# EAGLE design Martin-V-USB_Mame_Panel_Atmega8ISP-V18 (EAGLE 6.3)
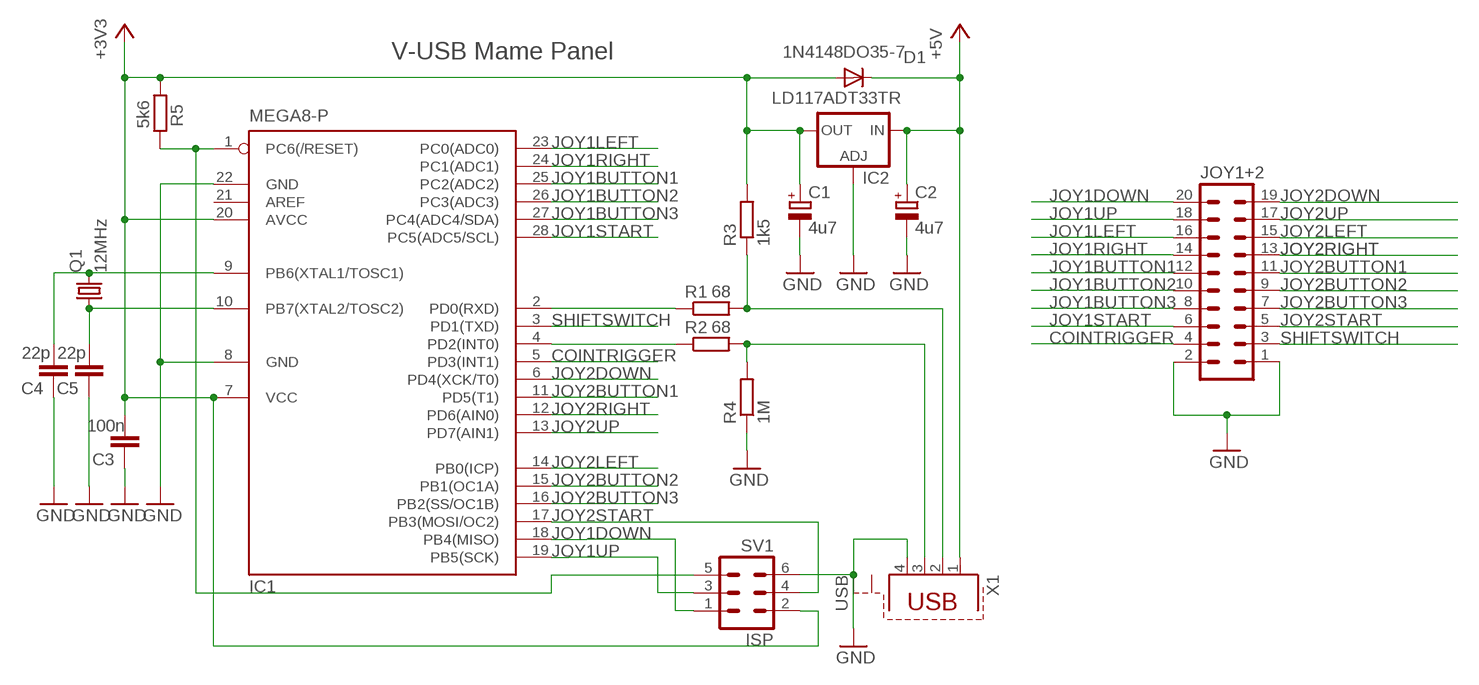
[diagram p0: schematic, sheet 1]

## Parts
C1  4u7  CPOL-EUE2.5-5  [E2,5-5]
C2  4u7  CPOL-EUE2.5-5  [E2,5-5]
C3  100n  C-EU050-030X075  [C050-030X075]
C4  22p  C-EU025-025X050  [C025-025X050]
C5  22p  C-EU025-025X050  [C025-025X050]
D1  1N4148DO35-7  [DO35-7]
IC1  MEGA8-P  [DIL28-3]
IC2  LD117ADT33TR  [DPACK]
JOY1+2  MA10-2W  [MA10-2W]
Q1  12MHz  CRYSTALHC18U-V  [HC18U-V]
R1  68  R-EU_0207/10  [0207/10]
R2  68  R-EU_0207/10  [0207/10]
R3  1k5  R-EU_0207/10  [0207/10]
R4  1M  R-EU_0207/10  [0207/10]
R5  5k6  R-EU_0207/10  [0207/10]
SV1  ISP  ML6  [ML6]
X1  USB  PN61729-S  [PN61729-S]

## Nets
+3V3: C1.+ C3.2 D1.A IC1.7(VCC) IC1.20(AVCC) IC2.4(OUT) R3.2 R5.1 SV1.2
+5V: C2.+ D1.C IC2.3(IN) X1.1
COINTRIGGER: IC1.5(PD3(INT1)) JOY1+2.4
GND: C1.- C2.- C3.1 C4.1 C5.1 IC1.8(GND) IC1.22(GND) IC2.1(ADJ) JOY1+2.1 JOY1+2.2 R4.1 SV1.6 X1.4
JOY1BUTTON1: IC1.25(PC2(ADC2)) JOY1+2.12
JOY1BUTTON2: IC1.26(PC3(ADC3)) JOY1+2.10
JOY1BUTTON3: IC1.27(PC4(ADC4/SDA)) JOY1+2.8
JOY1DOWN: IC1.18(PB4(MISO)) JOY1+2.20 SV1.1
JOY1LEFT: IC1.23(PC0(ADC0)) JOY1+2.16
JOY1RIGHT: IC1.24(PC1(ADC1)) JOY1+2.14
JOY1START: IC1.28(PC5(ADC5/SCL)) JOY1+2.6
JOY1UP: IC1.19(PB5(SCK)) JOY1+2.18 SV1.3
JOY2BUTTON1: IC1.11(PD5(T1)) JOY1+2.11
JOY2BUTTON2: IC1.15(PB1(OC1A)) JOY1+2.9
JOY2BUTTON3: IC1.16(PB2(SS/OC1B)) JOY1+2.7
JOY2DOWN: IC1.6(PD4(XCK/T0)) JOY1+2.19
JOY2LEFT: IC1.14(PB0(ICP)) JOY1+2.15
JOY2RIGHT: IC1.12(PD6(AIN0)) JOY1+2.13
JOY2START: IC1.17(PB3(MOSI/OC2)) JOY1+2.5 SV1.4
JOY2UP: IC1.13(PD7(AIN1)) JOY1+2.17
N$1: IC1.2(PD0(RXD)) R1.1
N$2: IC1.4(PD2(INT0)) R2.1
N$3: IC1.1(PC6(/RESET)) R5.2 SV1.5
N$4: R1.2 R3.1 X1.2
N$5: R2.2 R4.2 X1.3
N$10: C4.2 IC1.9(PB6(XTAL1/TOSC1)) Q1.2
N$11: C5.2 IC1.10(PB7(XTAL2/TOSC2)) Q1.1
SHIFTSWITCH: IC1.3(PD1(TXD)) JOY1+2.3
Unconnected: IC1.21(AREF) X1.S1 X1.S2

## Notes on the sheet
- V-USB Mame Panel

## Library data of the parts
C1 C2 = rcl:CPOL-EU: POLARIZED CAPACITOR, European symbol
C3-C5 = resistor:C-EU: CAPACITOR, European symbol
D1 = diode:1N4148: DIODE high speed (Philips)
IC1 = atmel:MEGA8-P: MICROCONTROLLER 8 Kbytes FLASH, 1 kbytes SRAM, 512 bytes EEPROM, USART, 4-channel 10 bit ADC, 2-channel 8 bit ADC Pin compatible with Atmega48, ATMega88, ATMega168 Source: avr.lbr
IC2 = v-reg:LD117A?*: Low drop fixed and adjustable positive voltage regulators 1 A Source: http://www.st.com/stonline/products/literature/ds/7194/ld1117axx.pdf
JOY1+2 = con-lstb:MA10-2W: PIN HEADER; OC_FARNELL: unknown; OC_NEWARK: unknown
Q1 = crystal:CRYSTAL: CRYSTAL
R1 R3-R5 = resistor:R-EU_: RESISTOR, European symbol
R2 = rcl:R-EU_: RESISTOR, European symbol
SV1 = con-harting-ml:ML6: HARTING
X1 = con-berg:PN61729-S: BERG USB connector; OC_FARNELL: unknown; OC_NEWARK: unknown

## Board
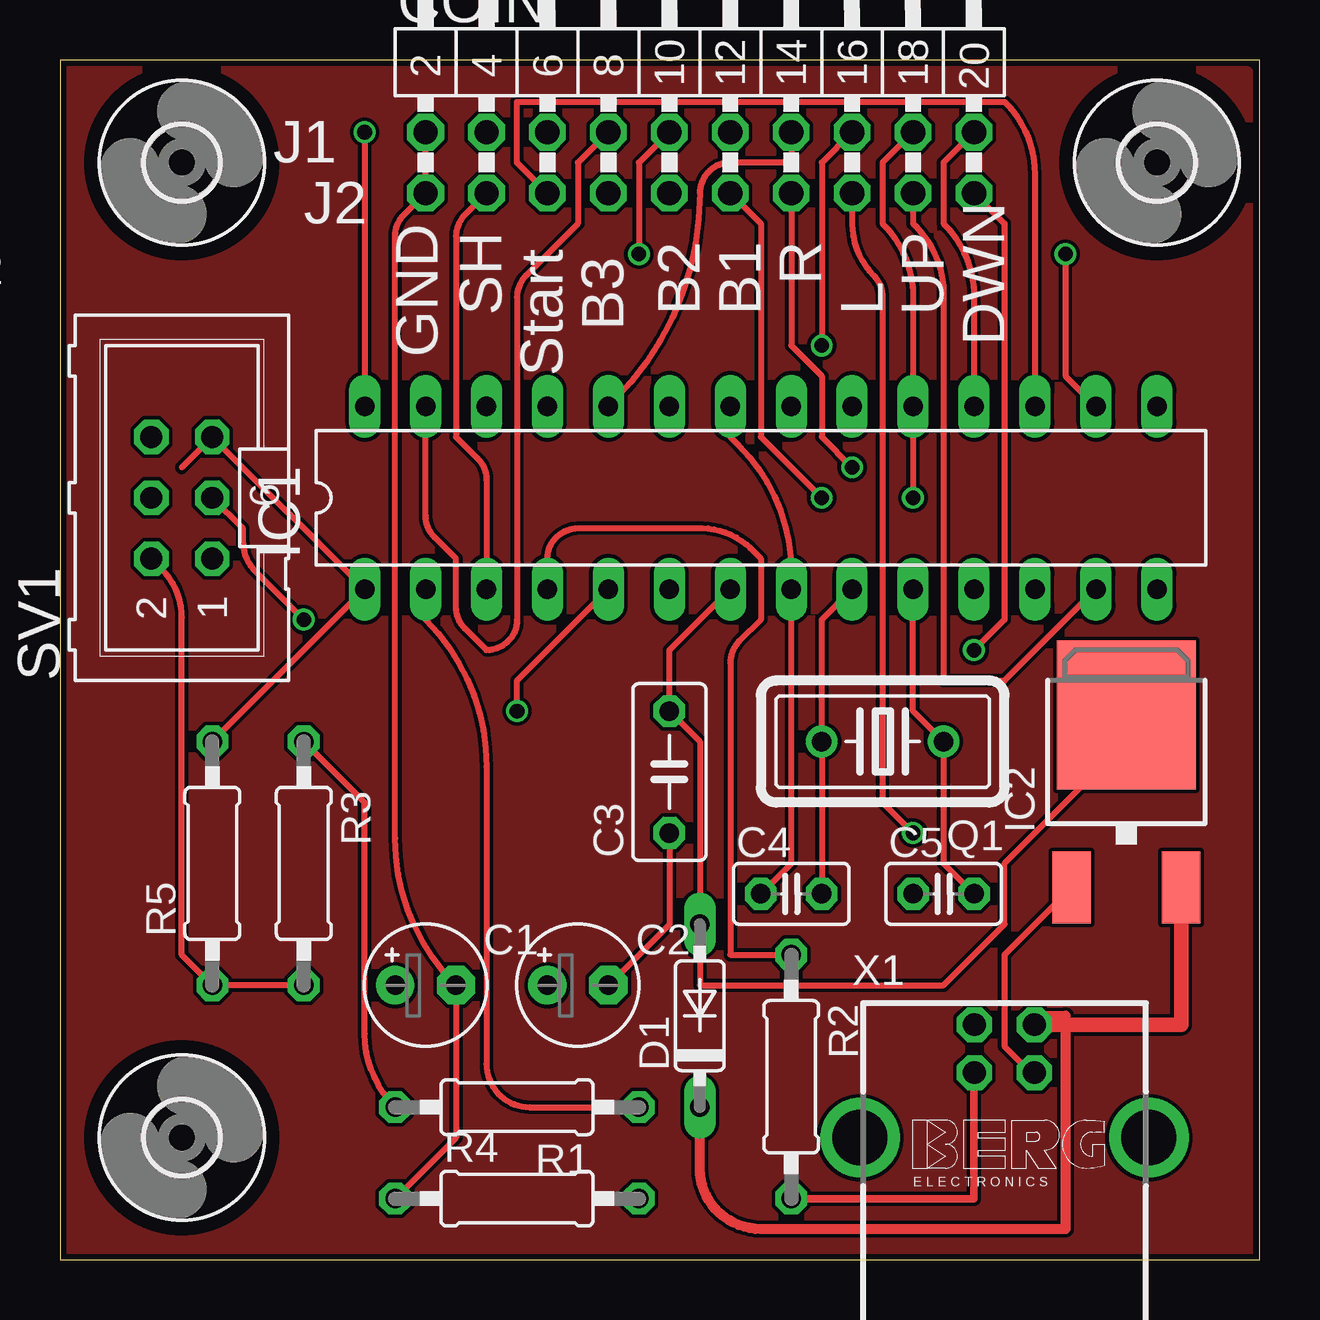
[diagram p1: board, top side]
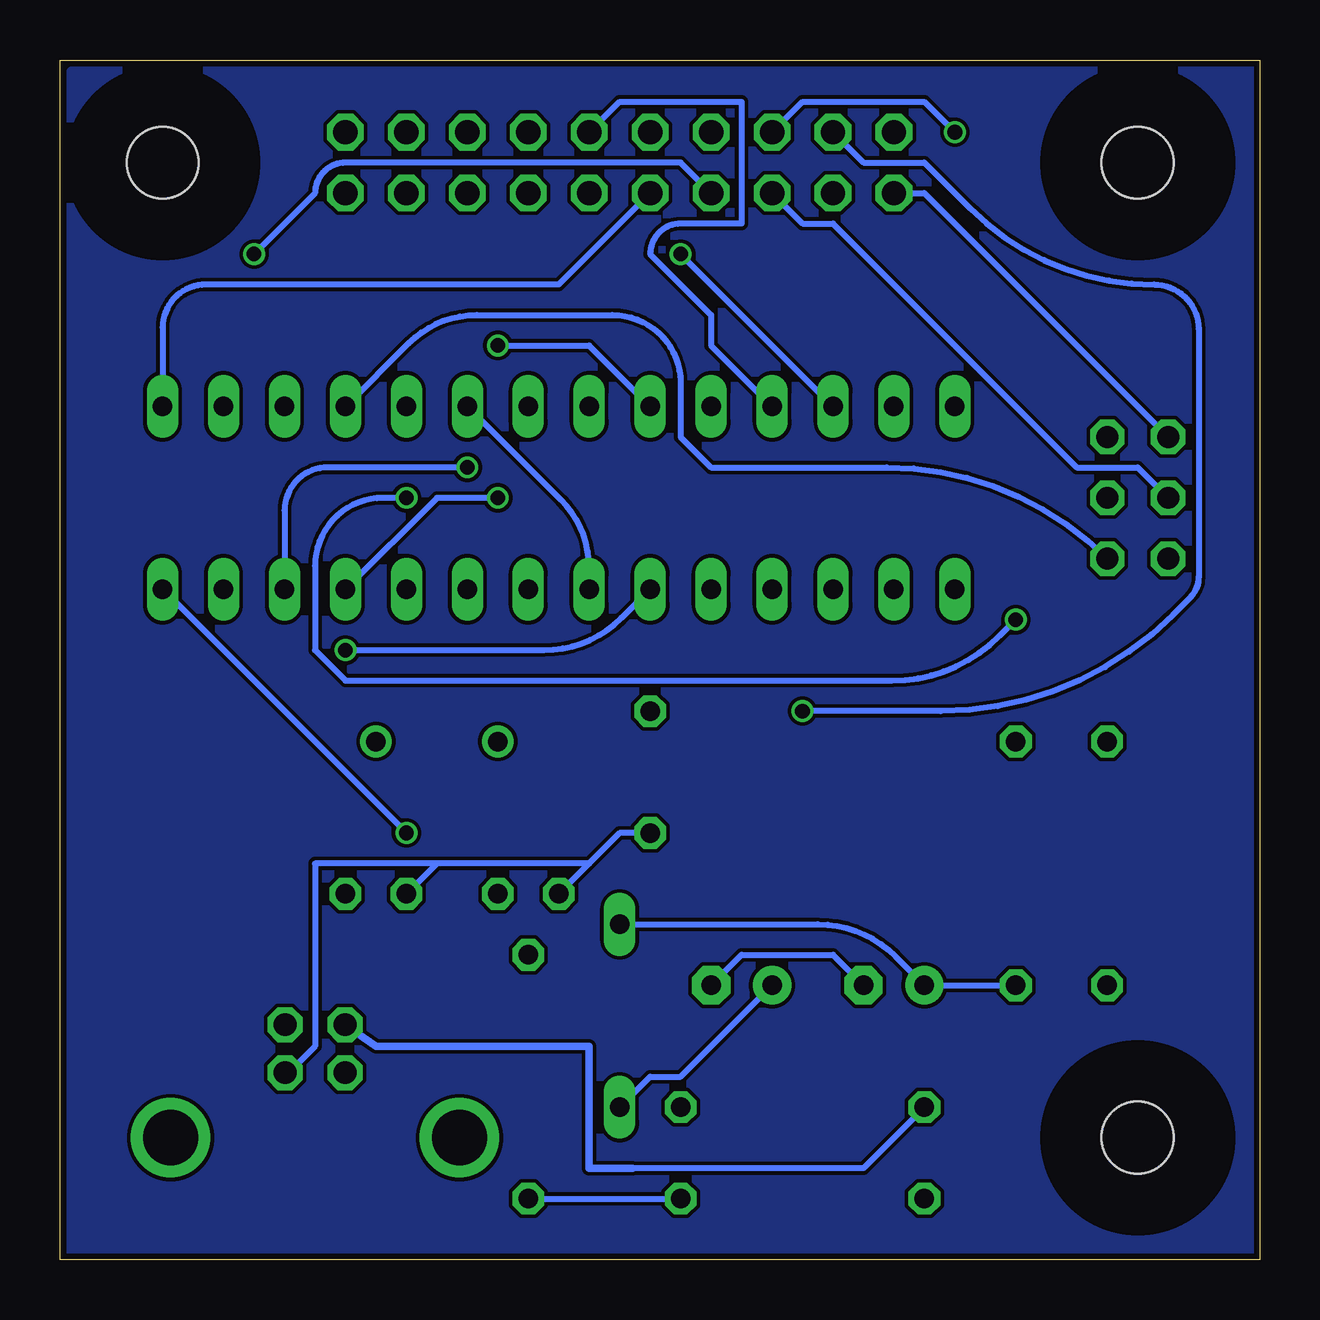
[diagram p2: board, bottom side, seen from below]

Size 50 x 50 mm. Coordinates in mm from the lower left corner, seen from the top.
Outline: 0,0 50,0 50,50 0,50 0,0
Copper layers (1*16): Top 0.035mm / dielectric 1.5mm / Bottom 0.035mm
Design rules "Fusion_eagle_rule_v1.1": minimum track width 6mil, minimum drill 12mil, track to track 6mil, track to pad 6mil, pad to pad 6mil, via to via 6mil, smd to smd 0mil, copper to edge 10mil, drill to drill 10mil, minimum pad ring 10mil, minimum via ring 6mil, stop-mask expansion 2mil, vias tented up to drill 100mil, thermal gap 10mil

### Footprints (pad centres in the part's own frame; a part is rotated, then mirrored left to right if it is on the bottom)
E2,5-5 = drill 0.813 pad 1.6: + -1.27,0 | drill 0.813 pad 1.6 octagon: - 1.27,0
C050-030X075 = drill 0.813 octagon: 1 -2.54,0; 2 2.54,0
C025-025X050 = drill 0.813 octagon: 1 -1.27,0; 2 1.27,0
DO35-7 = drill 0.813 long: A 3.81,0; C -3.81,0
DIL28-3 = drill 0.813 long: 1 -16.51,-3.81; 2 -13.97,-3.81; 3 -11.43,-3.81; 4 -8.89,-3.81; 5 -6.35,-3.81; 6 -3.81,-3.81; 7 -1.27,-3.81; 8 1.27,-3.81; 9 3.81,-3.81; 10 6.35,-3.81; 11 8.89,-3.81; 12 11.43,-3.81; 13 13.97,-3.81; 14 16.51,-3.81; 15 16.51,3.81; 16 13.97,3.81; 17 11.43,3.81; 18 8.89,3.81; 19 6.35,3.81; 20 3.81,3.81; 21 1.27,3.81; 22 -1.27,3.81; 23 -3.81,3.81; 24 -6.35,3.81; 25 -8.89,3.81; 26 -11.43,3.81; 27 -13.97,3.81; 28 -16.51,3.81
DPACK = smd 1.6 x 3: 1 -2.28,-4.8; 3 2.28,-4.8 | smd 5.8 x 6.2: 4 0,2.38
MA10-2W = drill 1.016 octagon: 1 -11.43,-1.27; 2 -11.43,1.27; 3 -8.89,-1.27; 4 -8.89,1.27; 5 -6.35,-1.27; 6 -6.35,1.27; 7 -3.81,-1.27; 8 -3.81,1.27; 9 -1.27,-1.27; 10 -1.27,1.27; 11 1.27,-1.27; 12 1.27,1.27; 13 3.81,-1.27; 14 3.81,1.27; 15 6.35,-1.27; 16 6.35,1.27; 17 8.89,-1.27; 18 8.89,1.27; 19 11.43,-1.27; 20 11.43,1.27
HC18U-V = drill 0.813: 1 -2.54,0; 2 2.54,0
0207/10 = drill 0.813 octagon: 1 -5.08,0; 2 5.08,0
ML6 = drill 0.914 octagon: 1 -2.54,-1.27; 2 -2.54,1.27; 3 0,-1.27; 4 0,1.27; 5 2.54,-1.27; 6 2.54,1.27
3,0 = hole 3: 0,0
PN61729-S = drill 0.95 octagon: 1 1.25,4.71; 2 -1.25,4.71; 3 -1.25,2.71; 4 1.25,2.71 | drill 2.3 pad 2.9: S1 -6.02,0; S2 6.02,0

### Placement (x,y rotation side)
C1  15.24,11.43 0 top
C2  21.59,11.43 0 top
C3  25.4,20.32 90 top
C4  30.48,15.24 0 top
C5  36.83,15.24 0 top
D1  26.67,10.16 90 top
IC1  29.21,31.75 0 top
IC2  44.45,20.32 0 top
JOY1+2  26.67,45.72 0 top
Q1  34.29,21.59 180 top
R1  19.05,6.35 180 top
R2  30.48,7.62 270 top
R3  10.16,16.51 270 top
R4  19.05,2.54 0 top
R5  6.35,16.51 90 top
SV1  5.08,31.75 90 top
U$1  [3,0]  5.08,5.08 0 top
U$2  [3,0]  45.72,45.72 0 top
U$3  [3,0]  5.08,45.72 0 top
X1  39.37,5.08 0 top

### Tracks (layer width: path | path; a pad name or v marks a point on that pad's centre or on a via)
+3V3
  Top 0.254: IC2.4 44.45,21.59 39.37,16.51 39.37,13.97 36.83,11.43 26.67,11.43 D1.A 26.67,21.59 C3.2 25.4,25.4 IC1.7 | R3.2 R5.1 5.08,12.7 5.08,26.76 arc45 4.25,28.77 SV1.2
  Bottom 0.254: IC1.7 27.94,28.82 arc-45 29.12,31.66 IC1.20 | D1.A 18.41,13.97 arc45 15.17,12.63 C1.+ R3.2
+5V
  Top 0.406: X1.1 40.62,10.16 41.91,10.16 41.91,1.27 29.21,1.27 arc-90 26.67,3.81 D1.C
  Top 0.61: X1.1 46.73,9.79 IC2.3
  Bottom 0.254: C2.+ 24.13,7.62 25.4,7.62 D1.C
COINTRIGGER  (via drill 0.61)
  Top 0.254: IC1.5 19.05,24.13 v19.05,22.86
  Bottom 0.254: v19.05,22.86 13.29,22.86 arc-45 3.61,26.87 2.91,27.57 arc-45 2.54,28.47 2.54,38.78 arc-90 4.39,40.64 arc45 12.07,43.82 13.97,45.72 16.51,45.72 JOY1+2.4
GND
  Top 0.254: JOY1+2.2 JOY1+2.1 14.34,43.55 arc45 13.97,42.65 13.97,17.56 arc45 C1.- 16.51,5.08 R4.1 | IC1.22 27.94,34.29 28.31,33.92 arc-45 30.48,28.68 IC1.8 30.48,16.51 C4.1 | C2.- 25.4,13.97 C3.1 | X1.4 40.64,7.62 39.37,8.89 39.37,12.7 41.91,15.24 IC2.1
  Bottom 0.254: C1.- 17.78,12.7 21.59,12.7 C2.- | SV1.6 13.97,44.45 JOY1+2.1 | 27.94,16.51 26.67,17.78 C3.1 | 27.94,16.51 C4.1 | 34.29,16.51 C5.1 | 27.94,16.51 34.29,16.51 | 34.29,16.51 39.37,16.51 39.37,8.89 40.64,7.62 X1.4
JOY1BUTTON1
  Bottom 0.254: IC1.25 22.86,38.1 22.86,39.37 25.4,41.91 arc90 24.13,43.18 21.59,43.18 21.59,48.26 26.67,48.26 JOY1+2.12
JOY1BUTTON2  (via drill 0.61)
  Top 0.254: v24.13,41.91 24.13,45.72 JOY1+2.10
  Bottom 0.254: v24.13,41.91 IC1.26
JOY1BUTTON3
  Top 0.254: IC1.27 15.24,31.01 arc45 15.61,30.11 16.51,29.21 16.51,27.2 arc45 16.88,26.3 17.78,25.4 arc90 19.05,26.67 19.05,40.11 arc-45 19.42,41.01 21.59,43.18 21.59,45.72 JOY1+2.8
JOY1DOWN
  Top 0.254: IC1.18 38.1,40.11 arc45 36.83,43.18 36.83,45.72 JOY1+2.20
  Bottom 0.254: SV1.1 arc-45 15.55,33.02 22.86,33.02 24.13,34.29 24.13,36.53 arc-90 26.97,39.37 32.63,39.37 arc-45 35.47,38.19 IC1.18
JOY1LEFT  (via drill 0.61)
  Top 0.254: v31.75,38.1 31.75,45.72 JOY1+2.16
  Bottom 0.254: IC1.23 27.94,38.1 v31.75,38.1
JOY1RIGHT
  Top 0.254: IC1.24 23.08,35.78 arc45 26.67,44.45 arc-90 27.94,45.72 30.48,45.72 JOY1+2.14
JOY1START  (via drill 0.61)
  Top 0.254: v12.7,46.99 IC1.28
  Bottom 0.254: v12.7,46.99 13.97,48.26 19.05,48.26 JOY1+2.6
JOY1UP  (via drill 0.61)
  Top 0.254: JOY1+2.18 34.29,45.72 34.29,43.18 arc-45 35.56,40.11 IC1.19 v35.56,31.75 | v10.16,26.67 8.15,28.68 arc-45 7.62,29.95 7.62,30.48 SV1.3
  Bottom 0.254: v35.56,31.75 36.53,31.75 arc-90 39.37,28.91 39.37,25.4 38.1,24.13 15.33,24.13 arc-45 10.84,25.99 v10.16,26.67
JOY2BUTTON1  (via drill 0.61)
  Top 0.254: v31.75,31.75 29.21,34.29 29.21,43.18 JOY1+2.11
  Bottom 0.254: IC1.11 34.29,31.75 v31.75,31.75
JOY2BUTTON2
  Bottom 0.254: IC1.15 45.72,38.84 arc90 43.92,40.64 29.21,40.64 JOY1+2.9
JOY2BUTTON3  (via drill 0.61)
  Top 0.254: IC1.16 41.91,36.83 v41.91,41.91
  Bottom 0.254: v41.91,41.91 39.37,44.45 arc90 38.1,45.72 24.13,45.72 JOY1+2.7
JOY2DOWN  (via drill 0.61)
  Top 0.254: v38.1,25.4 39.37,26.67 39.37,43.18 JOY1+2.19
  Bottom 0.254: v38.1,25.4 29.84,25.4 arc-45 26.6,26.74 IC1.6
JOY2LEFT  (via drill 0.61)
  Top 0.254: v35.56,17.78 34.29,19.05 34.29,40.11 arc45 33.92,41.01 arc-45 33.02,43.18 JOY1+2.15
  Bottom 0.254: v35.56,17.78 IC1.14
JOY2RIGHT  (via drill 0.61)
  Top 0.254: v33.02,33.02 31.75,34.29 31.75,36.83 30.48,38.1 JOY1+2.13
  Bottom 0.254: v33.02,33.02 38.84,33.02 arc-90 40.64,31.22 IC1.12
JOY2START
  Top 0.254: IC1.17 40.64,45.19 arc45 39.37,48.26 19.05,48.26 19.05,45.72 JOY1+2.5
  Bottom 0.254: SV1.4 5.08,33.02 7.62,33.02 17.78,43.18 19.05,43.18 JOY1+2.5
JOY2UP
  Top 0.254: IC1.13 39.37,24.13 36.83,24.13 36.83,40.25 arc45 35.65,43.09 35.56,43.18 JOY1+2.17
N$1
  Top 0.254: R1.1 19.58,6.35 arc-90 17.78,8.15 17.78,20.54 arc45 15.24,26.67 IC1.2
N$2
  Top 0.254: R2.1 27.94,12.7 27.94,24.87 arc-45 28.31,25.77 29.21,26.67 29.21,29.21 28.77,29.65 arc45 26.76,30.48 21.59,30.48 arc90 20.32,29.21 IC1.4
N$3
  Top 0.254: 5.08,33.02 SV1.5 IC1.1 R5.2
N$4
  Top 0.254: R3.1 12.7,19.05 12.7,9.42 arc45 R1.2
  Bottom 0.254: 26.13,3.81 16.51,3.81 R1.2
  Bottom 0.305: 26.13,3.81 27.94,3.81 27.94,8.89 36.83,8.89 X1.2
N$5
  Top 0.305: R2.2 38.1,2.54 38.1,7.79 X1.3
  Bottom 0.254: R2.2 R4.2
N$6
  pour Bottom: 0,0 0,49.53 49.53,49.53 49.53,0
N$7
  pour Top: 0,49.53 0,0 49.53,0 49.53,49.53
N$10
  Top 0.254: IC1.9 31.75,26.67 Q1.2 C4.2
N$11
  Top 0.254: C5.2 36.83,16.51 Q1.1 35.56,22.86 IC1.10
SHIFTSWITCH
  Top 0.254: IC1.3 17.78,32.49 arc45 17.41,33.39 16.51,34.29 16.51,42.65 arc-45 16.88,43.55 JOY1+2.3

### Text on the board
tNames: COIN | J1 | J2 | GND | R | SH | B3 | B2 | B1 | L | UP | DWN | Start